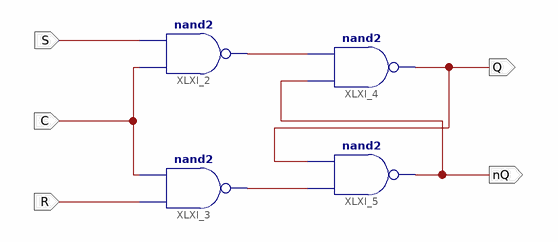
[diagram p0: schematic sheet 1]
// Xilinx ISE schematic CSR_LATCH.sch (kintex7) as structural Verilog: 4 symbols, 5 ports
module CSR_LATCH (
  input  C,
  input  S,
  input  R,
  output Q,
  output nQ
);

  wire XLXN_1, XLXN_5;

  nand XLXI_2 (XLXN_1, C, S);
  nand XLXI_3 (XLXN_5, R, C);
  nand XLXI_4 (Q, nQ, XLXN_1);
  nand XLXI_5 (nQ, XLXN_5, Q);
endmodule
